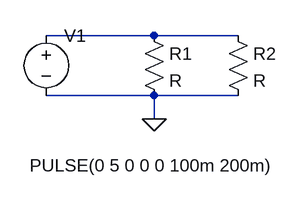
[diagram p0: schematic Draft4.asc]
Draft4.asc, the LTspice schematic file:
Version 4
SHEET 1 880 680
WIRE 192 112 48 112
WIRE 304 112 192 112
WIRE 192 192 48 192
WIRE 304 192 192 192
WIRE 192 224 192 192
FLAG 192 224 0
SYMBOL voltage 48 96 R0
WINDOW 3 -22 190 Left 2
WINDOW 123 0 0 Left 0
WINDOW 39 0 0 Left 0
SYMATTR InstName V1
SYMATTR Value PULSE(0 5 0 0 0 100m 200m)
SYMBOL res 176 96 R0
SYMATTR InstName R1
SYMBOL res 288 96 R0
SYMATTR InstName R2

The netlist it stands for:
* Draft4.asc
V1 N001 0 PULSE(0 5 0 0 0 100m 200m)
R1 N001 0 R
R2 N001 0 R
.backanno
.end